# Altium schematic sheet P02 Block.SchDoc
size 420 x 297 mm
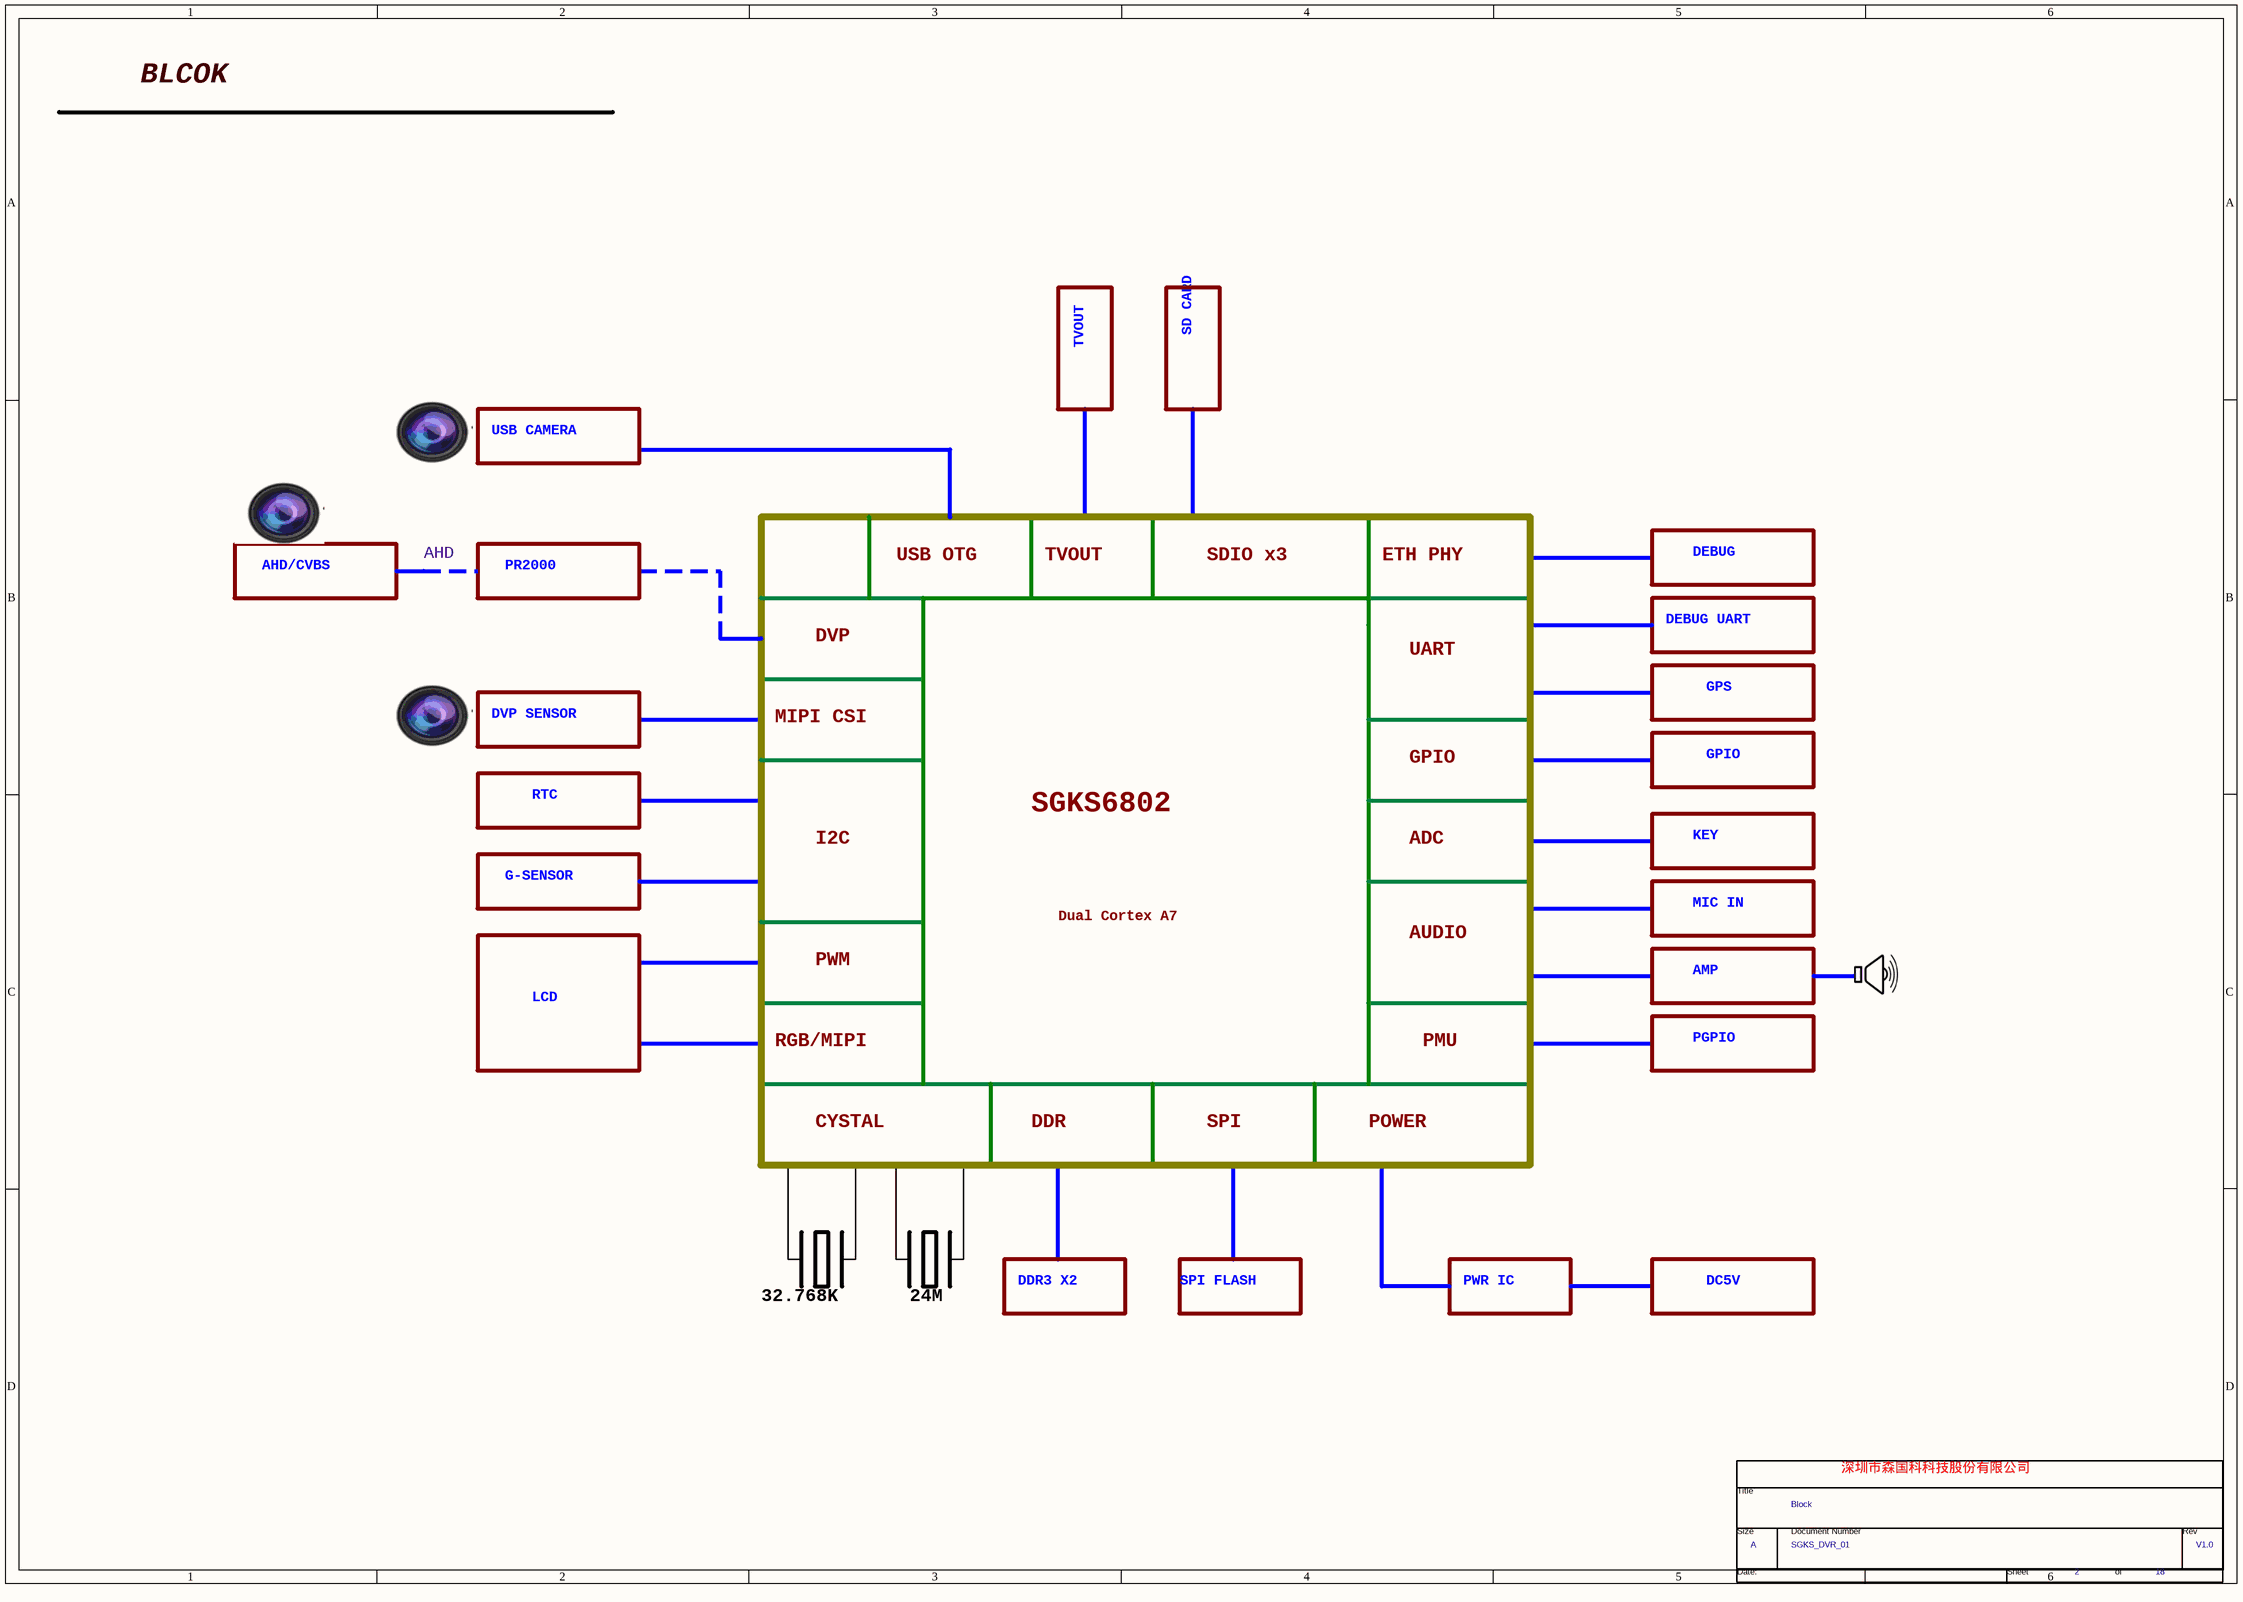
[diagram p0: P02 Block.SchDoc]

## Parts
*  Page Count: 18  Page Number: 2  Page Size: A  Title: Block  RevCode: V1.0  Doc: SGKS_DVR_01  (hidden comment: TitleBlock0)  (graphical)

## Notes on the sheet
- BLCOK
- TVOUT
- SD CARD
- USB CAMERA
- AHD/CVBS
- AHD
- PR2000
- USB OTG
- SDIO x3
- ETH PHY
- DEBUG
- DVP
- UART
- DEBUG UART
- DVP SENSOR
- MIPI CSI
- GPS
- RTC
- GPIO
- I2C
- SGKS6802
- ADC
- KEY
- G-SENSOR
- Dual Cortex A7
- MIC IN
- LCD
- PWM
- AUDIO
- AMP
- RGB/MIPI
- PMU
- PGPIO
- CYSTAL
- DDR
- SPI
- POWER
- 32.768K
- 24M
- DDR3 X2
- SPI FLASH
- PWR IC
- DC5V
- 深圳市森国科科技股份有限公司
- (in symbol TitleBlock0) Title; Size; Document Number; Rev; Date:; Sheet; of

## Library data of the parts
* = TitleBlock0: Page Create Date: March  8, 1995